# EAGLE board Replicape (EAGLE 5.11), part 1 of 2
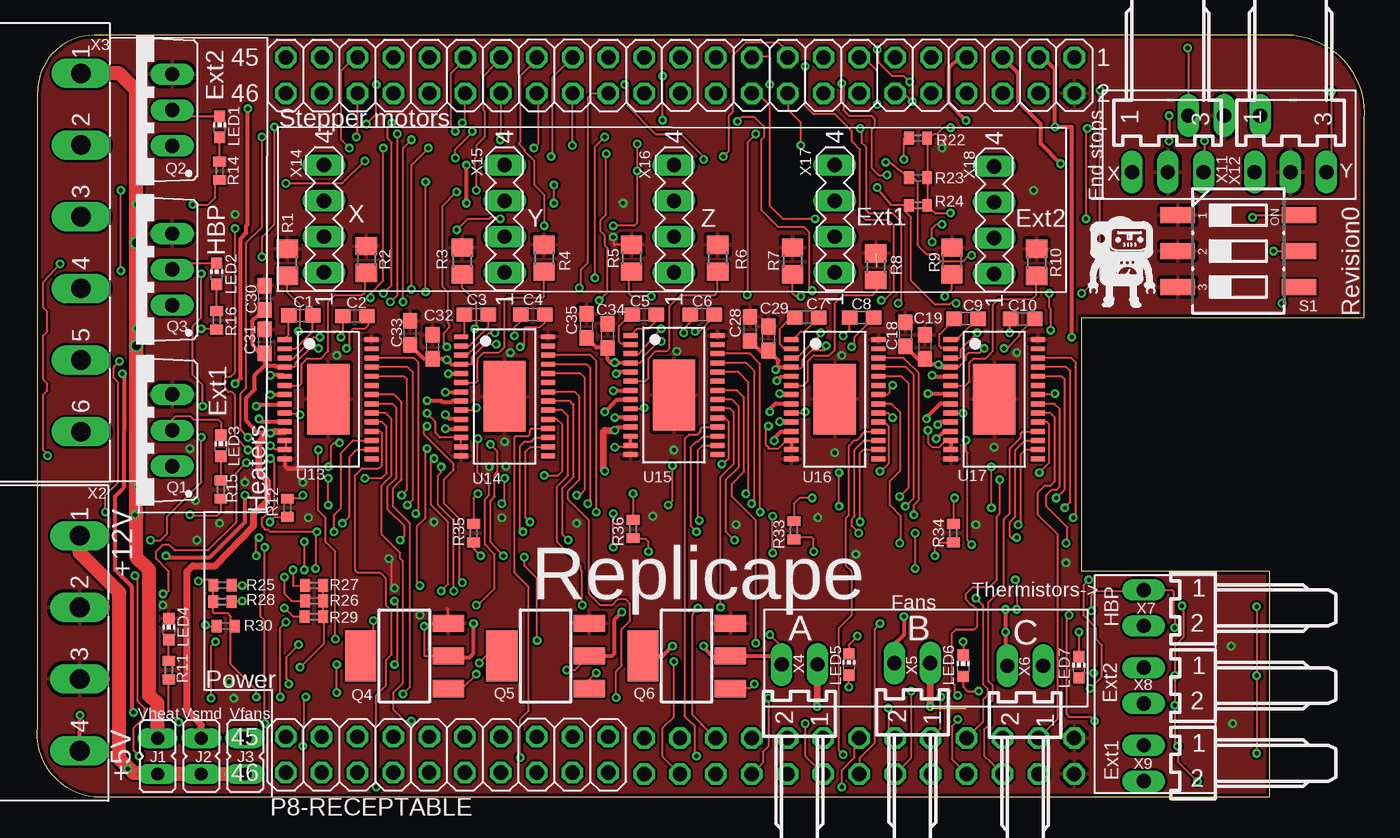
[diagram p2: board, top side]
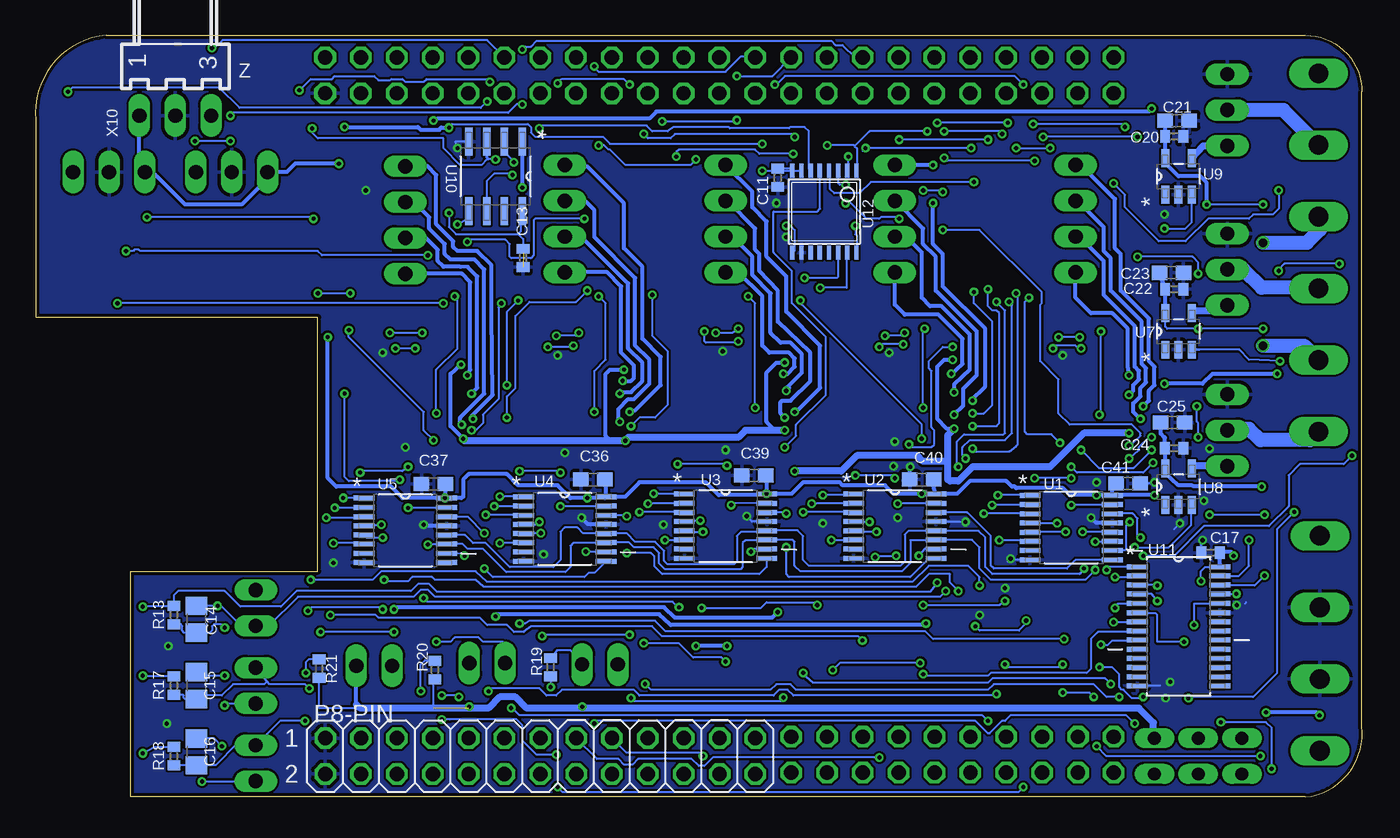
[diagram p3: board, bottom side, seen from below]

Size 94.05 x 54 mm. Coordinates in mm from the lower left corner, seen from the top.
Outline: 4.03,0 87.33,0 87.33,16 74.03,16 74.03,34 94.03,34 94.03,48 arc90 89.03,54 4.03,54 arc90 0.03,50 0.03,5 arc90 4.03,0
Copper layers (1*16): Top 0.035mm / dielectric 1.5mm / Bottom 0.035mm
Design rules "Fusion_eagle_rule_v1.1 *": minimum track width 6mil, minimum drill 0.3mm, track to track 6mil, track to pad 6mil, pad to pad 6mil, via to via 6mil, smd to smd 0mil, copper to edge 10mil, drill to drill 10mil, minimum pad ring 10mil, minimum via ring 6mil, stop-mask expansion 2mil, vias tented up to drill 100mil, thermal gap 10mil
Net classes: 1 power: width 1.27 mm

## Footprints (pad centres in the part's own frame; a part is rotated, then mirrored left to right if it is on the bottom)
C0603 = smd 1.1 x 1: 1 -0.85,0; 2 0.85,0
C0402 = smd 0.7 x 0.9: 1 -0.65,0; 2 0.65,0
C0805 = smd 1.3 x 1.5: 1 -0.95,0; 2 0.95,0
JP1 = drill 0.914 long: 1 0,-1.27; 2 0,1.27
CHIP-LED0603 = smd 0.8 x 0.8: A 0,-0.75; C 0,0.75
2X13 = drill 1.016 octagon: 1 15.24,-1.27; 2 15.24,1.27; 3 12.7,-1.27; 4 12.7,1.27; 5 10.16,-1.27; 6 10.16,1.27; 7 7.62,-1.27; 8 7.62,1.27; 9 5.08,-1.27; 10 5.08,1.27; 11 2.54,-1.27; 12 2.54,1.27; 13 0,-1.27; 14 0,1.27; 15 -2.54,-1.27; 16 -2.54,1.27; 17 -5.08,-1.27; 18 -5.08,1.27; 19 -7.62,-1.27; 20 -7.62,1.27; 21 -10.16,-1.27; 22 -10.16,1.27; 23 -12.7,-1.27; 24 -12.7,1.27; 25 -15.24,-1.27; 26 -15.24,1.27
2X10 = drill 1.016 octagon: 27 -11.43,-1.27; 28 -11.43,1.27; 29 -8.89,-1.27; 30 -8.89,1.27; 31 -6.35,-1.27; 32 -6.35,1.27; 33 -3.81,-1.27; 34 -3.81,1.27; 35 -1.27,-1.27; 36 -1.27,1.27; 37 1.27,-1.27; 38 1.27,1.27; 39 3.81,-1.27; 40 3.81,1.27; 41 6.35,-1.27; 42 6.35,1.27; 43 8.89,-1.27; 44 8.89,1.27; 45 11.43,-1.27; 46 11.43,1.27
2X23-R = drill 1.016 octagon: 1 -27.94,-1.27; 2 -27.94,1.27; 3 -25.4,-1.27; 4 -25.4,1.27; 5 -22.86,-1.27; 6 -22.86,1.27; 7 -20.32,-1.27; 8 -20.32,1.27; 9 -17.78,-1.27; 10 -17.78,1.27; 11 -15.24,-1.27; 12 -15.24,1.27; 13 -12.7,-1.27; 14 -12.7,1.27; 15 -10.16,-1.27; 16 -10.16,1.27; 17 -7.62,-1.27; 18 -7.62,1.27; 19 -5.08,-1.27; 20 -5.08,1.27; 21 -2.54,-1.27; 22 -2.54,1.27; 23 0,-1.27; 24 0,1.27; 25 2.54,-1.27; 26 2.54,1.27; 27 5.08,-1.27; 28 5.08,1.27; 29 7.62,-1.27; 30 7.62,1.27; 31 10.16,-1.27; 32 10.16,1.27; 33 12.7,-1.27; 34 12.7,1.27; 35 15.24,-1.27; 36 15.24,1.27; 37 17.78,-1.27; 38 17.78,1.27; 39 20.32,-1.27; 40 20.32,1.27; 41 22.86,-1.27; 42 22.86,1.27; 43 25.4,-1.27; 44 25.4,1.27; 45 27.94,-1.27; 46 27.94,1.27
TO220BV = drill 1.016 long: D 0,-2.54; G -2.54,-2.54; S 2.54,-2.54
SOT223 = smd 1.219 x 2.235: 1 -2.311,-3.099; 2 0,-3.099; 3 2.311,-3.099 | smd 3.6 x 2.2: 4 0,3.099
R0805 = smd 1.3 x 1.5: 1 -0.95,0; 2 0.95,0
R0402 = smd 0.7 x 0.9: 1 -0.65,0; 2 0.65,0
CTS-219-03 = smd 1.13 x 2.44: 1 -2.54,-4.3; 2 0,-4.3; 3 2.54,-4.3; 4 2.54,4.3; 5 0,4.3; 6 -2.54,4.3
SOP65P640X120-16N = smd 1.473 x 0.356: 1 -2.921,2.286; 2 -2.921,1.626; 3 -2.921,0.965; 4 -2.921,0.33; 5 -2.921,-0.33; 6 -2.921,-0.965; 7 -2.921,-1.626; 8 -2.921,-2.286; 9 2.921,-2.286; 10 2.921,-1.626; 11 2.921,-0.965; 12 2.921,-0.33; 13 2.921,0.33; 14 2.921,0.965; 15 2.921,1.626; 16 2.921,2.286
SOT95P280X145-5N = smd 1.27 x 0.559: 1 -1.295,0.94; 2 -1.295,0; 3 -1.295,-0.94; 4 1.295,-0.94; 5 1.295,0.94
SOIC127P600X175-8N = smd 1.981 x 0.533: 1 -2.464,1.905; 2 -2.464,0.635; 3 -2.464,-0.635; 4 -2.464,-1.905; 5 2.464,-1.905; 6 2.464,-0.635; 7 2.464,0.635; 8 2.464,1.905
SOP65P640X110-28N = smd 1.473 x 0.356: 1 -2.921,4.216; 2 -2.921,3.581; 3 -2.921,2.921; 4 -2.921,2.286; 5 -2.921,1.626; 6 -2.921,0.965; 7 -2.921,0.33; 8 -2.921,-0.33; 9 -2.921,-0.965; 10 -2.921,-1.626; 11 -2.921,-2.286; 12 -2.921,-2.921; 13 -2.921,-3.581; 14 -2.921,-4.216; 15 2.921,-4.216; 16 2.921,-3.581; 17 2.921,-2.921; 18 2.921,-2.286; 19 2.921,-1.626; 20 2.921,-0.965; 21 2.921,-0.33; 22 2.921,0.33; 23 2.921,0.965; 24 2.921,1.626; 25 2.921,2.286; 26 2.921,2.921; 27 2.921,3.581; 28 2.921,4.216
TSSOP-16 = smd 0.305 x 0.991: 1 -2.275,-2.918; 2 -1.625,-2.918; 3 -0.975,-2.918; 4 -0.325,-2.918; 5 0.325,-2.918; 6 0.975,-2.918; 7 1.625,-2.918; 8 2.275,-2.918; 9 2.275,2.918; 10 1.625,2.918; 11 0.975,2.918; 12 0.325,2.918; 13 -0.325,2.918; 14 -0.975,2.918; 15 -1.625,2.918; 16 -2.275,2.918
TSSOP-28 = smd 0.35 x 1: 1 -4.225,-3.087; 2 -3.575,-3.087; 3 -2.925,-3.087; 4 -2.275,-3.087; 5 -1.625,-3.087; 6 -0.975,-3.087; 7 -0.325,-3.087; 8 0.325,-3.087; 9 0.975,-3.087; 10 1.625,-3.087; 11 2.275,-3.087; 12 2.925,-3.087; 13 3.575,-3.087; 14 4.225,-3.087; 15 4.225,3.087; 16 3.575,3.087; 17 2.925,3.087; 18 2.275,3.087; 19 1.625,3.087; 20 0.975,3.087; 21 0.325,3.087; 22 -0.325,3.087; 23 -0.975,3.087; 24 -1.625,3.087; 25 -2.275,3.087; 26 -2.925,3.087; 27 -3.575,3.087; 28 -4.225,3.087 | smd 5 x 3: EXP 0,0
MSTBA4 = drill 1.397 long: 1 -7.62,5.08; 2 -2.54,5.08; 3 2.54,5.08; 4 7.62,5.08
MSTBA6 = drill 1.397 long: 1 -12.7,5.08; 2 -7.62,5.08; 3 -2.54,5.08; 4 2.54,5.08; 5 7.62,5.08; 6 12.7,5.08
7395-02 = drill 1.016 long: 1 1.27,0; 2 -1.27,0
7395-03 = drill 1.016 long: 1 2.54,0; 2 0,0; 3 -2.54,0
MA04-1 = drill 1.016 long: 1 -3.81,0; 2 -1.27,0; 3 1.27,0; 4 3.81,0

## Placement (x,y rotation side)
C1  10nF  [C0603]  18.68,34.15 180 top
C2  0.1uF  [C0603]  22.53,34.1 180 top
C3  10nF  [C0603]  31.13,34.2 180 top
C4  0.1uF  [C0603]  35.13,34.2 180 top
C5  10nF  [C0603]  43.03,34.2 0 top
C6  0.1uF  [C0603]  47.13,34.2 180 top
C7  10nF  [C0603]  54.53,34 0 top
C8  0.1uF  [C0603]  58.43,34 180 top
C9  10nF  [C0603]  65.83,33.9 0 top
C10  0.1uF  [C0603]  69.83,33.9 180 top
C11  0.1uF  [C0402]  41.43,43.9 270 bottom
C13  0.1uF  [C0402]  59.48,38.21 270 bottom
C14  10uF  [C0805]  82.63,12.6 90 bottom
C15  10uF  [C0805]  82.63,7.9 90 bottom
C16  10uF  [C0805]  82.63,3.2 90 bottom
C17  0.1uF  [C0402]  10.75,17.32 180 bottom
C18  4.7uF  [C0603]  61.53,32.8 90 top
C19  0.1uF  [C0603]  62.93,31.9 90 top
C20  0.1uF  [C0402]  13.33,46.82 0 bottom
C21  4.7uF  [C0603]  13.13,47.95 0 bottom
C22  0.1uF  [C0402]  13.33,36 0 bottom
C23  4.7uF  [C0603]  13.52,37.16 0 bottom
C24  0.1uF  [C0402]  13.34,24.73 0 bottom
C25  4.7uF  [C0603]  13.44,26.55 0 bottom
C28  4.7uF  [C0603]  50.53,33.2 90 top
C29  0.1uF  [C0603]  51.83,32.5 90 top
C30  4.7uF  [C0603]  16.13,35.4 90 top
C31  0.1uF  [C0603]  16.13,32.3 90 top
C32  4.7uF  [C0603]  28.03,31.9 90 top
C33  0.1uF  [C0603]  26.43,32.9 90 top
C34  4.7uF  [C0603]  40.43,32.7 90 top
C35  0.1uF  [C0603]  38.93,33.4 90 top
C36  0.1uF  [C0603]  54.53,22.5 180 bottom
C37  0.1uF  [C0603]  65.83,22.2 180 bottom
C39  0.1uF  [C0603]  43.13,22.8 180 bottom
C40  0.1uF  [C0603]  31.23,22.5 180 bottom
C41  0.1uF  [C0603]  16.59,22.23 0 bottom
J1  [JP1]  8.53,2.9 0 top
J2  [JP1]  11.63,2.9 0 top
J3  [JP1]  14.73,2.9 0 top
LED1  green  [CHIP-LED0603]  12.93,47.5 0 top
LED2  green  [CHIP-LED0603]  12.73,37.1 0 top
LED3  green  [CHIP-LED0603]  13.03,24.9 0 top
LED4  green  [CHIP-LED0603]  9.33,11.9 0 top
LED5  green  [CHIP-LED0603]  57.53,9.4 0 top
LED6  green  [CHIP-LED0603]  65.63,9.3 0 top
LED7  green  [CHIP-LED0603]  73.83,9.2 0 top
P8-PIN  BEAGLE_EXT8-SHORT-PIN  [2X13]  58.26,2.9 180 bottom
P8-RECEPTABLE  BEAGLE_EXT8-SHORT  [2X10]  29.05,3 180 top
P9-EXPANSION_A  BEAGLE_EXT9  [2X23-R]  45.57,51.16 180 top
Q1  [TO220BV]  7.03,26 90 top
Q2  [TO220BV]  7.03,48.7 90 top
Q3  [TO220BV]  7.03,37.4 90 top
Q4  NIF5002  [SOT223]  26.03,10 90 top
Q5  NIF5002  [SOT223]  36.03,10 90 top
Q6  NIF5002  [SOT223]  46.03,10 90 top
R1  0.1R  [R0805]  17.73,37.9 270 top
R2  0.1R  [R0805]  23.33,38.1 270 top
R3  0.1R  [R0805]  30.13,38 270 top
R4  0.1R  [R0805]  35.93,38.2 270 top
R5  0.1R  [R0805]  42.13,38.2 270 top
R6  0.1R  [R0805]  48.23,38.2 270 top
R7  0.1R  [R0805]  53.53,38 270 top
R8  0.1R  [R0805]  59.43,37.6 270 top
R9  0.1R  [R0805]  64.83,38 270 top
R10  0.1R  [R0805]  70.83,37.9 270 top
R11  1K  [R0402]  9.33,9 270 top
R12  1K  [R0402]  17.73,20.5 90 top
R13  4K7  [R0402]  84.23,12.9 90 bottom
R14  1K  [R0402]  12.93,44.4 270 top
R15  1K  [R0402]  13.03,21.8 270 top
R16  1K  [R0402]  12.73,33.8 270 top
R17  4K7  [R0402]  84.23,7.9 90 bottom
R18  4K7  [R0402]  84.23,2.9 90 bottom
R19  1K  [R0402]  57.53,9.2 90 bottom
R20  1K  [R0402]  65.73,9 270 bottom
R21  1K  [R0402]  73.93,9.1 270 bottom
R22  1K  [R0402]  62.43,46.7 0 top
R23  1K  [R0402]  62.43,43.9 0 top
R24  1K  [R0402]  62.43,41.95 0 top
R25  1K  [R0402]  13.14,15.01 180 top
R26  1K  [R0402]  19.63,13.9 0 top
R27  1K  [R0402]  19.63,15 0 top
R28  1K  [R0402]  13.13,13.86 180 top
R29  1K  [R0402]  19.62,12.79 0 top
R30  1K  [R0402]  13.36,12.11 0 top
R33  1K  [R0402]  53.63,18.9 90 top
R34  1K  [R0402]  64.93,18.7 90 top
R35  1K  [R0402]  30.93,18.7 90 top
R36  1K  [R0402]  42.23,19 90 top
S1  219-03  [CTS-219-03]  85.13,38.7 270 top
U1  SN74AHC595PW  [SOP65P640X120-16N]  20.63,19.1 0 bottom
U2  SN74AHC595PW  [SOP65P640X120-16N]  33.13,19.2 0 bottom
U3  SN74AHC595PW  [SOP65P640X120-16N]  45.13,19.2 0 bottom
U4  SN74AHC595PW  [SOP65P640X120-16N]  56.53,19 0 bottom
U5  SN74AHC595PW  [SOP65P640X120-16N]  67.83,18.9 0 bottom
U7  TPS2829DBVT  [SOT95P280X145-5N]  13.03,33 90 bottom
U8  TPS2829DBVT  [SOT95P280X145-5N]  13.03,22 90 bottom
U9  TPS2829DBVT  [SOT95P280X145-5N]  13.03,44 90 bottom
U10  M24C16-WMN6P  [SOIC127P600X175-8N]  61.43,44 270 bottom
U11  PCA9685PW  [SOP65P640X110-28N]  13.03,12.1 0 bottom
U12  DAC088S085  [TSSOP-16]  38.13,41.5 180 bottom
U13  DRV8825PWP  [TSSOP-28]  20.63,28.2 270 top
U14  DRV8825PWP  [TSSOP-28]  33.13,28.4 270 top
U15  DRV8825PWP  [TSSOP-28]  45.13,28.5 270 top
U16  DRV8825PWP  [TSSOP-28]  56.53,28.2 270 top
U17  DRV8825PWP  [TSSOP-28]  67.83,28.2 270 top
U$1  [LOGO_BIG]  76.43,38 0 top
X2  MSTBA4  [MSTBA4]  -2.07,10.9 270 top
X3  MSTBA6  [MSTBA6]  -1.97,38.6 270 top
X4  22-05-7028-02  [7395-02]  54.03,9.4 0 top
X5  22-05-7028-02  [7395-02]  62.03,9.5 0 top
X6  22-05-7028-02  [7395-02]  70.03,9.3 0 top
X7  22-05-7028-02  [7395-02]  78.43,13.4 90 top
X8  22-05-7028-02  [7395-02]  78.43,7.9 90 top
X9  22-05-7028-02  [7395-02]  78.43,2.4 90 top
X10  22-05-7038-03  [7395-03]  84.13,48.3 180 bottom
X11  22-05-7038-03  [7395-03]  80.13,44.3 180 top
X12  22-05-7038-03  [7395-03]  88.83,44.3 180 top
X14  [MA04-1]  20.33,41 90 top
X15  [MA04-1]  33.13,41 90 top
X16  [MA04-1]  45.13,41 90 top
X17  [MA04-1]  56.53,41 90 top
X18  [MA04-1]  67.83,40.9 90 top